# EAGLE design mochila_full (EAGLE 9.2.2)
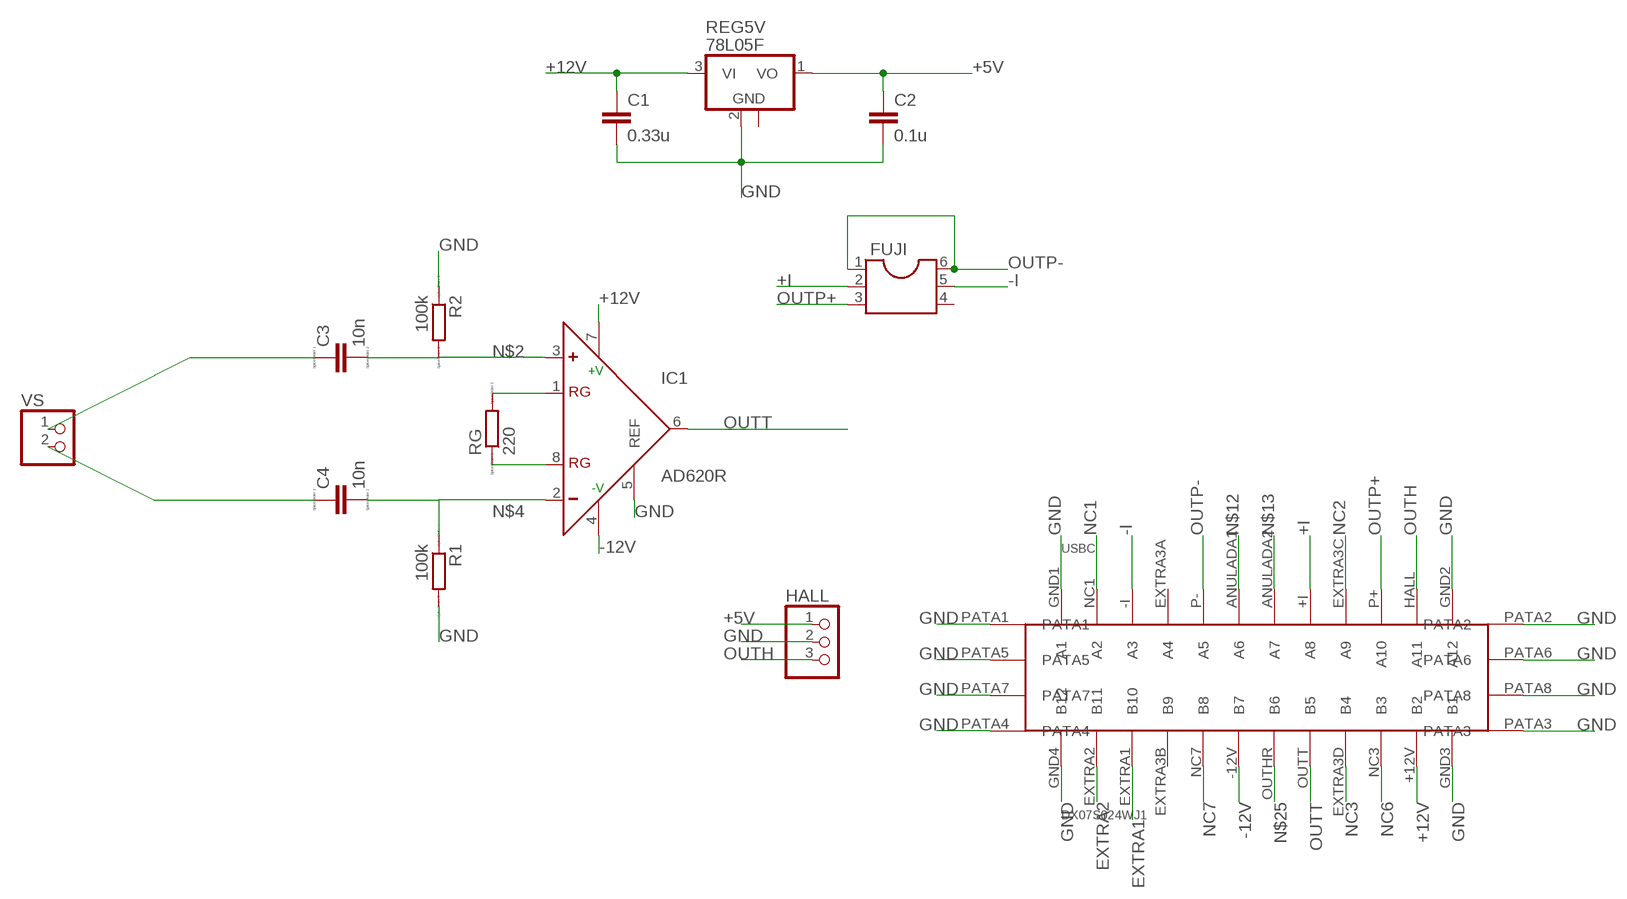
[diagram p0: schematic, sheet 1]

## Parts
C1  0.33u  C-EUC0805  [C0805]
C2  0.1u  C-EUC0805  [C0805]
C3  10n  C  [C0805]
C4  10n  C  [C0805]
FUJI  DIL6  [DIL06]
HALL  PINHD-1X3  [1X03]
IC1  AD620R  [SO8]
R1  100k  R  [R0805]
R2  100k  R  [R0805]
REG5V  78L05F  [SOT89]
RG  220  R  [R0805]
USBC  DX07S024WJ1  [DX07S024WJ1]
VS  PINHD-1X2  [1X02]

## Nets
+5V: C2.1 HALL.1 REG5V.1(VO)
+12V: C1.1 IC1.7(+V) REG5V.3(VI) USBC.+12V(B2)
+I: FUJI.2 USBC.+I(A8)
-12V: IC1.4(-V) USBC.-12V(B7)
-I: FUJI.5 USBC.-I(A3)
EXTRA1: USBC.EXTRA1(B10)
EXTRA2: USBC.EXTRA2(B11)
GND: C1.2 C2.2 HALL.2 IC1.5(REF) R1.2 R2.1 REG5V.2(GND) USBC.GND1(A1) USBC.GND2(A12) USBC.GND3(B1) USBC.GND4(B12) USBC.PATA1 USBC.PATA2 USBC.PATA3 USBC.PATA4 USBC.PATA5 USBC.PATA6 USBC.PATA7 USBC.PATA8
N$1: C3.1 VS.1
N$2: C3.2 IC1.3(+) R2.2
N$3: C4.1 VS.2
N$4: C4.2 IC1.2(-) R1.1
N$5: IC1.1(RG) RG.2
N$6: IC1.8(RG) RG.1
N$12: USBC.ANULADA1(A6)
N$13: USBC.ANULADA2(A7)
N$25: USBC.OUTHR(B6)
NC1: USBC.NC1(A2)
NC2: USBC.EXTRA3C(A9)
NC3: USBC.EXTRA3D(B4)
NC6: USBC.NC3(B3)
NC7: USBC.NC7(B8)
OUTH: HALL.3 USBC.HALL(A11)
OUTP+: FUJI.3 USBC.P+(A10)
OUTP-: FUJI.1 FUJI.6 USBC.P-(A5)
OUTT: IC1.6(OUT) USBC.OUTT(B5)
Unconnected: FUJI.4 REG5V.2@1(GND) USBC.EXTRA3A(A4) USBC.EXTRA3B(B9)

## Library data of the parts
C1 C2 = rcl:C-EU: CAPACITOR, European symbol
C3 C4 = eagle-ltspice:C: CAPACITOR, European symbol; SPICEMODEL: NONE; SPICEPREFIX: C
FUJI = ic-package:DIL6: Dual In Line / Socket
HALL = pinhead:PINHD-1X3: PIN HEADER
IC1 = analog-devices:AD620: Low Cost, Low Power, Instrumentation Amplifier Source: http://www.analog.com/UploadedFiles/Data_Sheets/37793330023930AD620_e.pdf; MPN: AD620AR; OC_FARNELL: 1464424; OC_NEWARK: 05F7109
R1 R2 RG = eagle-ltspice:R: RESISTOR, European symbol; SPICEMODEL: NONE; SPICEPREFIX: R
REG5V = linear:78L*: POSITOIV-VOLTAGE REGULATORS Output up to 100 mA Source: Datasheet <http://focus.ti.com/lit/ds/symlink/ua78l05.pdf>
USBC = USBC_LSD:DX07S024WJ1: DX07S024WJ1 - Conector USB-C Hembra para PCB Technical Specifications: Montura superficial 90° (vertical) Digikey: DX07S024WJ1 <https://www.digikey.com/product-detail/en/jae-electronics/DX07S024WJ1R350/670-2949-1-ND/6594045> Datasheet <http://www.jae.com/z-en/pdf_download_exec.cfm?param=MB-0297-3E_0301-2E_DX07.pdf> Drawing <http://www.jae.com/z-en/pdf_download_exec.cfm?param=SJ117219.pdf>
VS = pinhead:PINHD-1X2: PIN HEADER

## Board
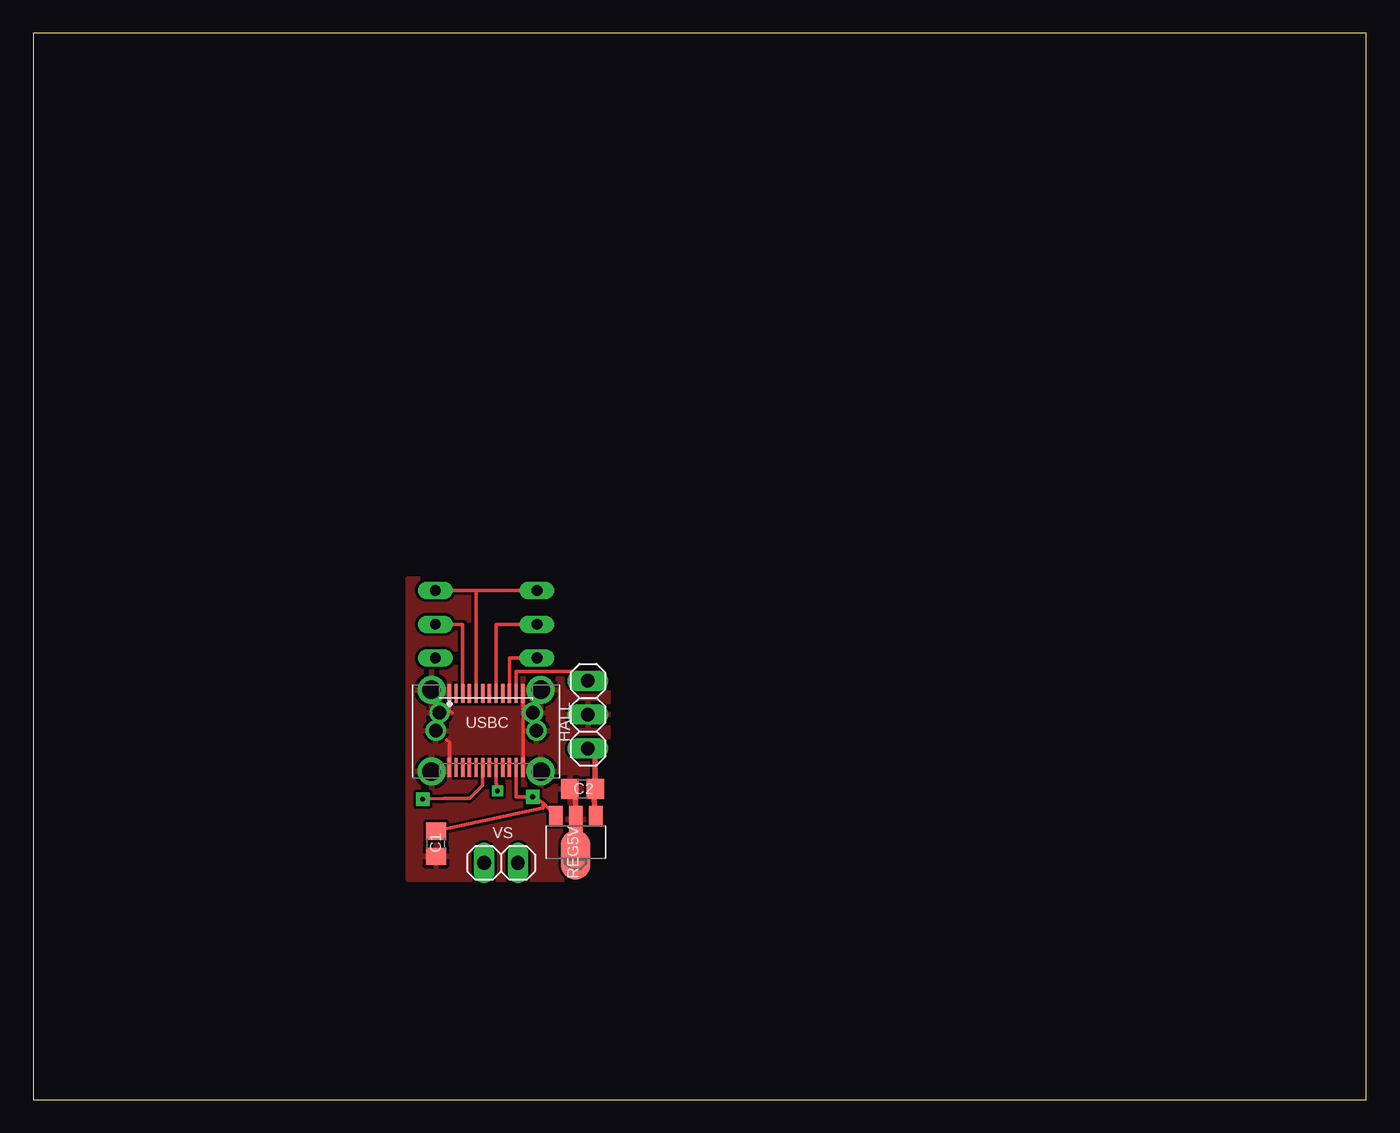
[diagram p1: board, top side]
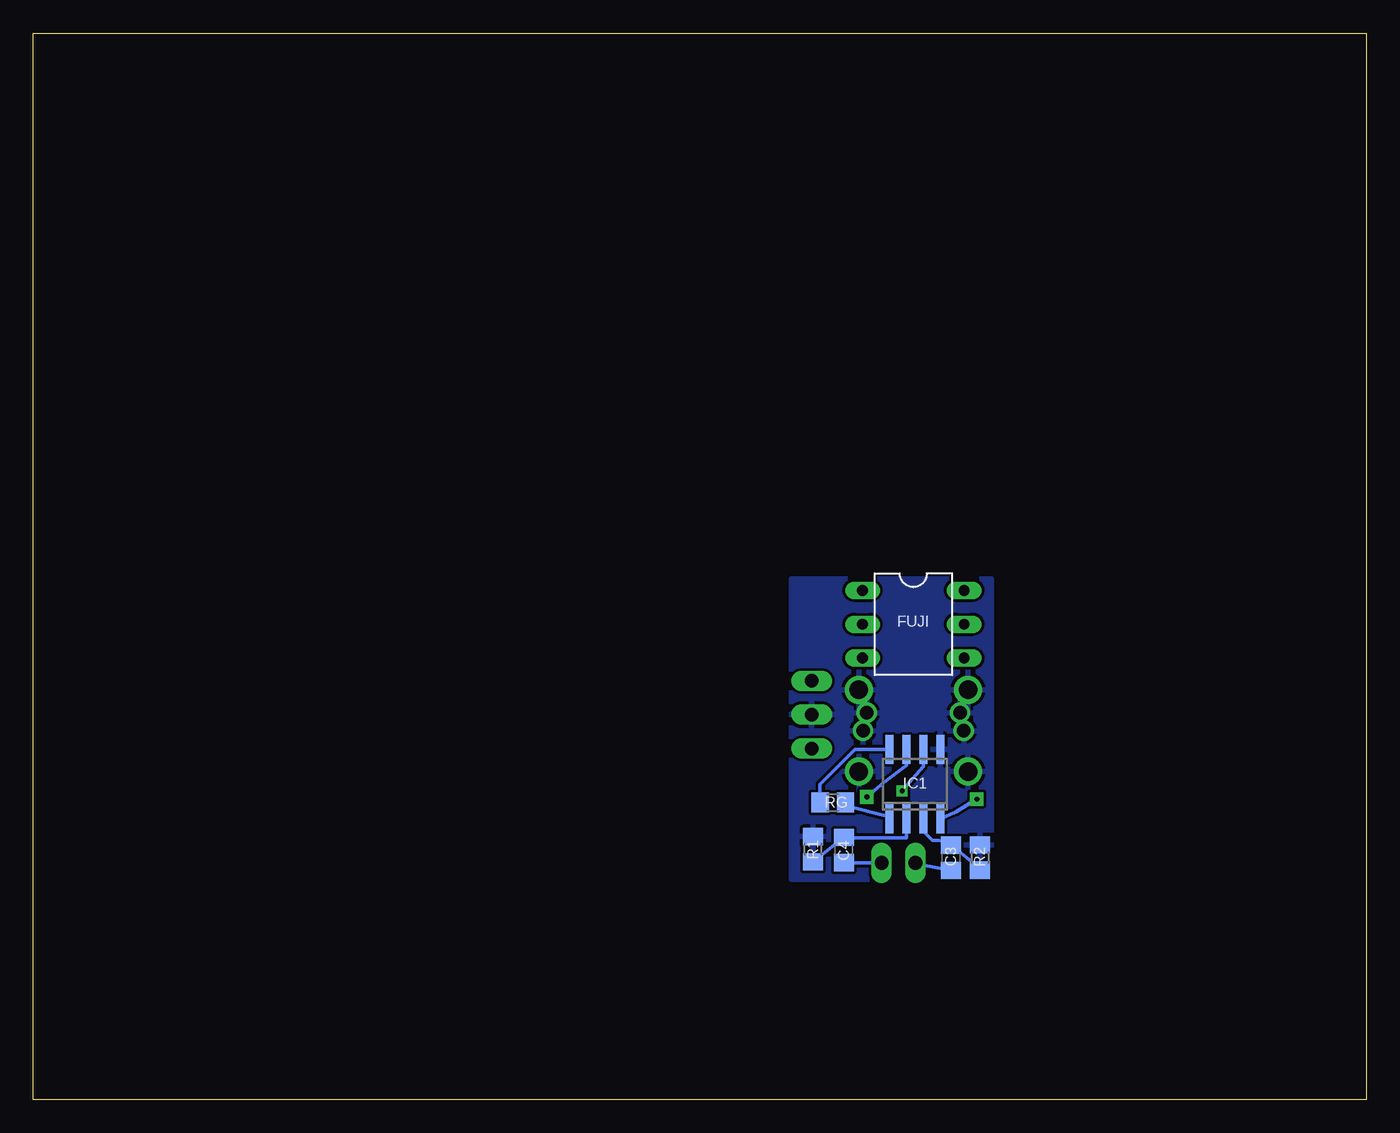
[diagram p2: board, bottom side, seen from below]

Size 100 x 80 mm. Coordinates in mm from the lower left corner, seen from the top.
Outline: 0,0 100,0 100,80 0,80 0,0
Copper layers (1*16): Top 0.035mm / dielectric 1.5mm / Bottom 0.035mm
Design rules "default *": minimum track width 10mil, minimum drill 24mil, track to track 8mil, track to pad 8mil, pad to pad 8mil, via to via 8mil, smd to smd 8mil, copper to edge 12mil, drill to drill 10mil, minimum pad ring 10mil, minimum via ring 8mil, stop-mask expansion 4mil, vias tented up to drill 0mil, thermal gap 10mil

### Footprints (pad centres in the part's own frame; a part is rotated, then mirrored left to right if it is on the bottom)
C0805 = smd 1.3 x 1.5: 1 -0.95,0; 2 0.95,0
DIL06 = drill 0.813 long: 1 -2.54,-3.81; 2 0,-3.81; 3 2.54,-3.81; 4 2.54,3.81; 5 0,3.81; 6 -2.54,3.81
1X03 = drill 1.016 long: 1 -2.54,0; 2 0,0; 3 2.54,0
SO8 = smd 0.6 x 2.2: 1 -1.905,-2.6; 2 -0.635,-2.6; 3 0.635,-2.6; 4 1.905,-2.6; 5 1.905,2.6; 6 0.635,2.6; 7 -0.635,2.6; 8 -1.905,2.6
R0805 = smd 1.3 x 1.5: 1 -0.95,0; 2 0.95,0
SOT89 = smd 1 x 1.5: 1 -1.499,-1.981; 3 1.499,-1.981 | smd 1 x 2: 2 0,-1.727 | smd 2.2 x 3.7: 2@1 0,0.94
DX07S024WJ1 = smd 0.254 x 1.4: +12V 2.25,-2.7; +I 0.75,2.85; -12V -0.25,-2.7; -I -1.75,2.85; ANULADA1 -0.25,2.85; ANULADA2 0.25,2.85; EXTRA1 -1.75,-2.7; EXTRA2 -2.25,-2.7; EXTRA3A -1.25,2.85; EXTRA3B -1.25,-2.7; EXTRA3C 1.25,2.85; EXTRA3D 1.25,-2.7; GND1 -2.75,2.85; GND2 2.75,2.85; GND3 2.75,-2.7; GND4 -2.75,-2.7; HALL 2.25,2.85; NC1 -2.25,2.85; NC3 1.75,-2.7; NC7 -0.75,-2.7; OUTHR 0.25,-2.7; OUTT 0.75,-2.7; P+ 1.75,2.85; P- -0.75,2.85 | drill 1.4 pad 1.6: PATA1 -4.1,3.12; PATA2 4.1,3.12; PATA3 4.1,-3.02; PATA4 -4.1,-3.02 | drill 1 pad 1.1: PATA5 -3.5,1.4; PATA6 3.5,1.4 | drill 1 pad 1.2: PATA7 -3.775,0.05; PATA8 3.775,0.05
1X02 = drill 1.016 long: 1 -1.27,0; 2 1.27,0

### Placement (x,y rotation side)
C1  30.2,19.2 270 top
C2  41.2,23.3 180 top
C3  31.15,18.14 90 bottom
C4  39.19,18.71 90 bottom
FUJI  33.97,35.66 270 bottom
HALL  41.61,28.88 90 top
IC1  33.85,23.67 0 bottom
R1  41.5,18.78 90 bottom
R2  28.99,18.16 270 bottom
REG5V  40.7,19.3 180 top
RG  40.02,22.29 0 bottom
USBC  33.97,27.62 0 top
VS  35.09,17.75 0 top

### Tracks (layer width: path | path; a pad name or v marks a point on that pad's centre or on a via)
+5V
  Top 0.406: HALL.1 42.15,26.04 C2.1 42.04,23 REG5V.1
+12V  (via drill 0.35 pad 1.02)
  Top 0.254: USBC.+12V 36.22,22.71 v37.46,22.71 37.62,22.71 38.24,22.24 | REG5V.3 38.24,22.24 | C1.1 38.24,21.89 38.24,22.24
  Bottom 0.254: IC1.7 34.49,25.08 36.2,23.81 v37.46,22.71
+I
  Top 0.254: USBC.+I 34.72,35.66 FUJI.2
-12V  (via drill 0.35 pad 1.02)
  Top 0.254: v29.21,22.54 30.81,22.58 32.72,22.58 33.72,23.58 USBC.-12V
  Bottom 0.254: v29.21,22.54 30.8,21.59 IC1.4
-I
  Top 0.254: USBC.-I 32.22,35.66 FUJI.5
GND
  Top 0.254: USBC.GND3 36.73,25.75 | 36.73,25.75 36.74,26.34 | USBC.GND4 31.22,26.78 31,27 | USBC.GND1 31.2,30.45 31.2,29.2 31.4,29 | USBC.GND2 36.73,29.41 | 36.73,29.41 36.73,29.11 | 36.73,29.41 36.76,25.76 | 36.76,25.76 36.76,25.35 | 36.73,25.75 36.73,25.76 36.76,25.76
  Top 0.406: REG5V.2 40.7,23 C2.2
  pour Top: 28.12,39.05 43.13,39.05 43.13,16.51 28.12,16.51
  pour Bottom: 28.12,39.05 43.13,39.05 43.13,16.51 28.12,16.51
N$1
  Bottom 0.254: VS.1 33.75,17.69 C3.1
N$2
  Bottom 0.254: C3.2 29.02,17.37 R2.2 | C3.2 31.6,19.39 32.07,19.44 32.54,19.44 33.22,20.11 IC1.3 | C3.2 30.95,18.89 30.78,18.89
N$3
  Bottom 0.254: C4.1 39.16,17.74 VS.2
N$4
  Bottom 0.254: R1.1 C4.2 38.56,19.63 34.49,19.63 IC1.2
N$5
  Bottom 0.254: RG.2 38.98,22.02 35.87,21.26 IC1.1
N$6
  Bottom 0.254: 35.81,25.58 IC1.8 38.35,26.27 40.97,23.66 RG.1
OUTH
  Top 0.254: USBC.HALL 36.22,32.12 40.4,32.12 40.4,31.42 HALL.3
OUTP+
  Top 0.254: USBC.P+ 35.72,33.12 FUJI.3
OUTP-
  Top 0.254: USBC.P- 33.22,38.2 | 33.22,38.2 FUJI.6 | FUJI.1 33.22,38.2
OUTT  (via drill 0.35 pad 0.81)
  Top 0.254: v34.83,23.16 34.72,23.81 USBC.OUTT
  Bottom 0.254: v34.83,23.16 33.22,25 IC1.6